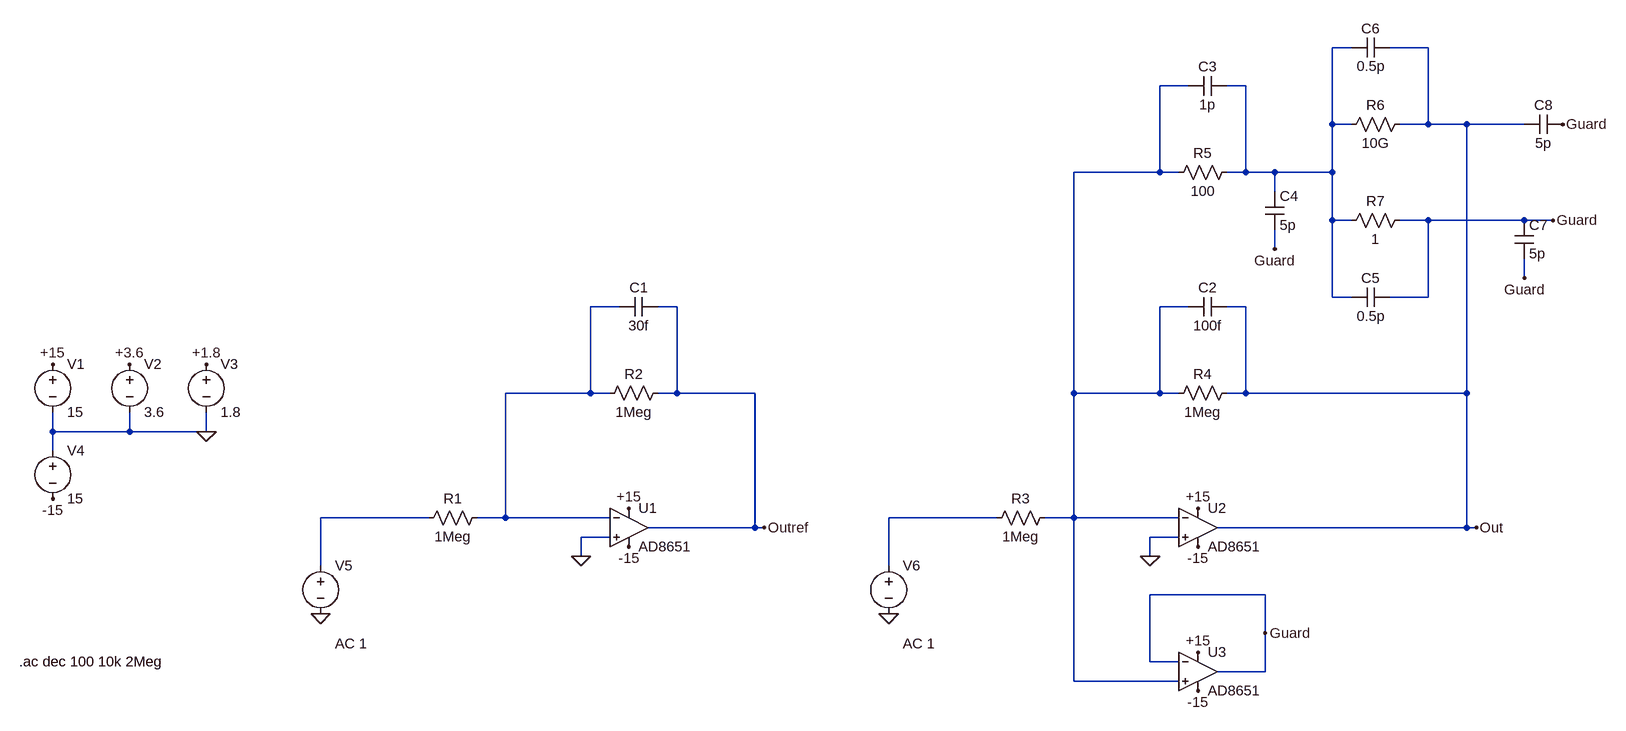
[diagram p0: schematic switching.asc]
switching.asc, the LTspice schematic file:
Version 4.1
SHEET 1 3564 772
WIRE 3056 -448 3024 -448
WIRE 3184 -448 3120 -448
WIRE 2784 -384 2736 -384
WIRE 2880 -384 2848 -384
WIRE 3024 -320 3024 -448
WIRE 3056 -320 3024 -320
WIRE 3184 -320 3184 -448
WIRE 3184 -320 3136 -320
WIRE 3248 -320 3184 -320
WIRE 3344 -320 3248 -320
WIRE 2736 -240 2736 -384
WIRE 2736 -240 2496 -240
WIRE 2768 -240 2736 -240
WIRE 2880 -240 2880 -384
WIRE 2880 -240 2848 -240
WIRE 2928 -240 2880 -240
WIRE 3024 -240 3024 -320
WIRE 3024 -240 2928 -240
WIRE 2928 -208 2928 -240
WIRE 3024 -160 3024 -240
WIRE 3056 -160 3024 -160
WIRE 3184 -160 3136 -160
WIRE 3344 -160 3184 -160
WIRE 3392 -160 3344 -160
WIRE 2928 -112 2928 -144
WIRE 3344 -64 3344 -96
WIRE 3024 -32 3024 -160
WIRE 3056 -32 3024 -32
WIRE 3184 -32 3184 -160
WIRE 3184 -32 3120 -32
WIRE 1312 -16 1264 -16
WIRE 1408 -16 1376 -16
WIRE 2784 -16 2736 -16
WIRE 2880 -16 2848 -16
WIRE 1264 128 1264 -16
WIRE 1264 128 1024 128
WIRE 1296 128 1264 128
WIRE 1408 128 1408 -16
WIRE 1408 128 1376 128
WIRE 1776 128 1408 128
WIRE 2496 128 2496 -240
WIRE 2736 128 2736 -16
WIRE 2736 128 2496 128
WIRE 2768 128 2736 128
WIRE 2880 128 2880 -16
WIRE 2880 128 2848 128
WIRE 3248 128 3248 -320
WIRE 3248 128 2880 128
WIRE 64 192 64 160
WIRE 192 192 192 160
WIRE 192 192 64 192
WIRE 320 192 320 160
WIRE 320 192 192 192
WIRE 64 224 64 192
WIRE 896 336 704 336
WIRE 1024 336 1024 128
WIRE 1024 336 976 336
WIRE 1296 336 1024 336
WIRE 2368 336 2176 336
WIRE 2496 336 2496 128
WIRE 2496 336 2448 336
WIRE 2768 336 2496 336
WIRE 1776 352 1776 128
WIRE 1776 352 1360 352
WIRE 1792 352 1776 352
WIRE 3248 352 3248 128
WIRE 3248 352 2832 352
WIRE 3264 352 3248 352
WIRE 1296 368 1248 368
WIRE 2768 368 2720 368
WIRE 1248 400 1248 368
WIRE 2720 400 2720 368
WIRE 704 416 704 336
WIRE 2176 416 2176 336
WIRE 2912 464 2720 464
WIRE 2912 528 2912 464
WIRE 2720 576 2720 464
WIRE 2768 576 2720 576
WIRE 2912 592 2912 528
WIRE 2912 592 2832 592
WIRE 2496 608 2496 336
WIRE 2768 608 2496 608
FLAG 64 80 +15
FLAG 192 80 +3.6
FLAG 320 80 +1.8
FLAG 64 304 -15
FLAG 1328 320 +15
FLAG 1328 384 -15
FLAG 1248 400 0
FLAG 320 192 0
FLAG 704 496 0
FLAG 1792 352 Outref
FLAG 2800 320 +15
FLAG 2800 384 -15
FLAG 2720 400 0
FLAG 2176 496 0
FLAG 3264 352 Out
FLAG 2800 560 +15
FLAG 2800 624 -15
FLAG 2912 528 Guard
FLAG 3392 -160 Guard
FLAG 2928 -112 Guard
FLAG 3344 -64 Guard
FLAG 3408 -320 Guard
SYMBOL voltage 64 64 R0
WINDOW 123 0 0 Left 0
WINDOW 39 0 0 Left 0
SYMATTR InstName V1
SYMATTR Value 15
SYMBOL voltage 192 64 R0
WINDOW 123 0 0 Left 0
WINDOW 39 0 0 Left 0
SYMATTR InstName V2
SYMATTR Value 3.6
SYMBOL voltage 320 64 R0
WINDOW 123 0 0 Left 0
WINDOW 39 0 0 Left 0
SYMATTR InstName V3
SYMATTR Value 1.8
SYMBOL voltage 64 208 R0
WINDOW 123 0 0 Left 0
WINDOW 39 0 0 Left 0
SYMATTR InstName V4
SYMATTR Value 15
SYMBOL OpAmps\\AD8651 1328 288 R0
SYMATTR InstName U1
SYMBOL res 992 320 R90
WINDOW 0 0 56 VBottom 2
WINDOW 3 32 56 VTop 2
SYMATTR InstName R1
SYMATTR Value 1Meg
SYMBOL voltage 704 400 R0
WINDOW 123 24 146 Left 2
WINDOW 39 0 0 Left 0
SYMATTR InstName V5
SYMATTR Value ""
SYMATTR Value2 AC 1
SYMBOL res 1392 112 R90
WINDOW 0 0 56 VBottom 2
WINDOW 3 32 56 VTop 2
SYMATTR InstName R2
SYMATTR Value 1Meg
SYMBOL cap 1376 -32 R90
WINDOW 0 0 32 VBottom 2
WINDOW 3 32 32 VTop 2
SYMATTR InstName C1
SYMATTR Value 30f
SYMBOL OpAmps\\AD8651 2800 288 R0
SYMATTR InstName U2
SYMBOL res 2464 320 R90
WINDOW 0 0 56 VBottom 2
WINDOW 3 32 56 VTop 2
SYMATTR InstName R3
SYMATTR Value 1Meg
SYMBOL voltage 2176 400 R0
WINDOW 123 24 146 Left 2
WINDOW 39 0 0 Left 0
SYMATTR InstName V6
SYMATTR Value ""
SYMATTR Value2 AC 1
SYMBOL res 2864 112 R90
WINDOW 0 0 56 VBottom 2
WINDOW 3 32 56 VTop 2
SYMATTR InstName R4
SYMATTR Value 1Meg
SYMBOL cap 2848 -32 R90
WINDOW 0 0 32 VBottom 2
WINDOW 3 32 32 VTop 2
SYMATTR InstName C2
SYMATTR Value 100f
SYMBOL res 2864 -256 R90
WINDOW 0 0 56 VBottom 2
WINDOW 3 32 56 VTop 2
SYMATTR InstName R5
SYMATTR Value 100
SYMBOL cap 2848 -400 R90
WINDOW 0 0 32 VBottom 2
WINDOW 3 32 32 VTop 2
SYMATTR InstName C3
SYMATTR Value 1p
SYMBOL cap 2912 -208 R0
SYMATTR InstName C4
SYMATTR Value 5p
SYMBOL res 3152 -336 R90
WINDOW 0 0 56 VBottom 2
WINDOW 3 32 56 VTop 2
SYMATTR InstName R6
SYMATTR Value 10G
SYMBOL res 3152 -176 R90
WINDOW 0 0 56 VBottom 2
WINDOW 3 32 56 VTop 2
SYMATTR InstName R7
SYMATTR Value 1
SYMBOL OpAmps\\AD8651 2800 528 R0
SYMATTR InstName U3
SYMBOL cap 3120 -48 R90
WINDOW 0 0 32 VBottom 2
WINDOW 3 32 32 VTop 2
SYMATTR InstName C5
SYMATTR Value 0.5p
SYMBOL cap 3120 -464 R90
WINDOW 0 0 32 VBottom 2
WINDOW 3 32 32 VTop 2
SYMATTR InstName C6
SYMATTR Value 0.5p
SYMBOL cap 3328 -160 R0
SYMATTR InstName C7
SYMATTR Value 5p
SYMBOL cap 3408 -336 R90
WINDOW 0 0 32 VBottom 2
WINDOW 3 32 32 VTop 2
SYMATTR InstName C8
SYMATTR Value 5p
TEXT 8 576 Left 2 !.ac dec 100 10k 2Meg

The netlist it stands for:
* switching.asc
V1 +15 0 15
V2 +3.6 0 3.6
V3 +1.8 0 1.8
V4 0 -15 15
X§U1 0 N003 +15 -15 Outref AD8651  ; pins In+ In- V+ V- OUT
R1 N003 N004 1Meg
V5 N004 0 AC 1
R2 Outref N003 1Meg
C1 Outref N003 30f
X§U2 0 N002 +15 -15 Out AD8651  ; pins In+ In- V+ V- OUT
R3 N002 N005 1Meg
V6 N005 0 AC 1
R4 Out N002 1Meg
C2 Out N002 100f
R5 N001 N002 100
C3 N001 N002 1p
C4 N001 Guard 5p
R6 Out N001 10G
R7 Guard N001 1
X§U3 N002 Guard +15 -15 Guard AD8651  ; pins In+ In- V+ V- OUT
C5 Guard N001 0.5p
C6 Out N001 0.5p
C7 Guard Guard 5p
C8 Guard Out 5p
.ac dec 100 10k 2Meg
.backanno
.end